# Altium schematic sheet SensWear_Memory.SchDoc
size A4; Size: A4; SheetNumber: 3; SheetTotal: 9
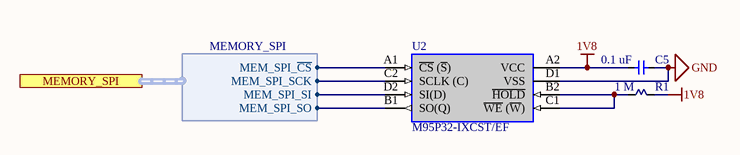
[diagram p0: SensWear_Memory.SchDoc]

## Parts
C5  0.1 uF  [CAPC1005X05N]
R1  1 M  [RESC1005X04N]
U2  M95P32-IXCST/EF  [BGA8C70P2X4_153X261X58]

## Ports
MEMORY_SPI (harness MEMORY_SPI)

## Harnesses
MEMORY_SPI: MEM_SPI_~{CS}, MEM_SPI_SI, MEM_SPI_SO, MEM_SPI_SCK

## Nets
1V8: C5.2 R1.2 U2.A2(VCC)
GND: C5.1 U2.D1(VSS)
NetR1_1: R1.1 U2.B2(~{HOLD}) U2.C1(~{WE}_(~{W}))
NetU2_A1: U2.A1(~{CS}_(~{S})) ; port MEMORY_SPI.MEM_SPI_~{CS}
NetU2_B1: U2.B1(SO(Q)) ; port MEMORY_SPI.MEM_SPI_SO
NetU2_C2: U2.C2(SCLK_(C)) ; port MEMORY_SPI.MEM_SPI_SCK
NetU2_D2: U2.D2(SI(D)) ; port MEMORY_SPI.MEM_SPI_SI

## Notes on the sheet
- Designer/Engineer
- Drawn By
- Document Name
- Board Title
- Sheet
- of
- Size
- A4
- Approved By
- Rev.
- Date

## Library data of the parts
C5 = GRM155R61C104KA88D: CAP CER 0.1UF 16V X5R 0402; Manufacturer: Murata Electronics; Tolerance: 10 %; Type: Chip Multilayer Ceramic Capacitor for General Purpose; Voltage Rating DC: 16 VDC; Capacitance - nF: 100 nF; Capacitance - pF: 100000 pF; Supplier 1: Mouser; Manufacturer Part Number: GRM155R61C104KA88D; RoHS: RoHS Compliant; Category: Multilayer Ceramic Capacitors MLCC - SMD/SMT; Packaging: Cut Tape; Capacitance: 0.1 uF; Package / Case: 0402 (1005 metric); ComponentLink1URL: http://www.mouser.com/datasheet/2/281/murata_03052018_GRM_Series_1-1310166.pdf; ComponentLink1Description: http://www.mouser.com/datasheet/2/281/murata_03052018_GRM_Series_1-1310166.pdf; Supplier Part Number 1: 81-GRM155R61C104KA8D; Value: 0.1 uF; Stock: 0; Pricing: 1=0.082, 10=0.026, 100=0.011, 500=0.008, 1000=0.007, 2500=0.006, 5000=0.005, 10000=0.004 (EUR); Height: 0.5 mm; Length: 1 mm; Product: General Type MLCCs; Series: GRM; Termination Style: SMD/SMT; Width: 0.5 mm; Brand: Murata Electronics; Case Code - in: 0402; Case Code - mm: 1005; Dielectric: X5R; Maximum Operating Temperature: + 85 C; Minimum Operating Temperature: - 55 C; Standard Pack Qty: 10000; Termination: Standard; RoHS - Mouser: Y; Minimum Order Quantity: 1; Reeling: True; Supplier 2: Digikey; Supplier Part Number 2: 490-5415-1-ND; Supplier 3: Digikey; Supplier Part Number 3: 490-5415-6-ND
R1 = ERJ-2RKF1004X: RES SMD 1M OHM 1% 1/10W 0402; Manufacturer: Panasonic Electronic Components; Power (Watts): 0.1W, 1/10W; Temperature Coefficient: ±100ppm/°C; Supplier 1: Digi-Key; Manufacturer Part Number: ERJ-2RKF1004X; RoHS: RoHS Compliant; Category: Resistors; Stock 1: 1590446; Pricing 1: 1=0.1, 10=0.025, 25=0.018, 50=0.0136, 100=0.01, 250=0.00764, 500=0.00612, 1000=0.00451, 5000=0.00323 (USD); Packaging: Digi-Reel®; Part Status: Active; Resistance (Ohms): 1M; Tolerance: ±1%; Composition: Thick Film; Features: Automotive AEC-Q200; Operating Temperature: -55°C ~ 155°C; Package / Case: 0402 (1005 Metric); Supplier Device Package: 0402; Size / Dimension: 0.039" L x 0.020" W (1.00mm x 0.50mm); Height - Seated (Max): 0.016" (0.40mm); Number of Terminations: 2; Failure Rate: -; ComponentLink1URL: https://industrial.panasonic.com/cdbs/www-data/pdf/RDA0000/AOA0000C283.pdf; ComponentLink1Description: https://industrial.panasonic.com/cdbs/www-data/pdf/RDA0000/AOA0000C283.pdf; Supplier Part Number 1: P1.00MLDKR-ND; Value: 1 M
U2 = M95P32-IXCST/EF: M95P32-I Series 32 Mb (4 M x 8) 80 MHz SPI EEPROM Memory IC - WLCSP-8; Manufacturer: STMicroelectronics; Supplier: Digikey; Supplier Part Number: 497-M95P32-IXCST/EFDKR-ND; Manufacturer Part Number: M95P32-IXCST/EF; RoHS: No; Category: Memory; Stock: 9222; Pricing: 1=2.68, 10=2.409, 25=2.2724, 100=1.9362, 250=1.818, 500=1.59076, 1000=1.31805, 2500=1.22715 (USD); Supplier 1: Mouser; Supplier Part Number 1: 511-M95P32-IXCST/EF; Supplier 2: Digikey; Supplier Part Number 2: 497-M95P32-IXCST/EFCT-ND